# EAGLE design NIBB (EAGLE 8.1.0)
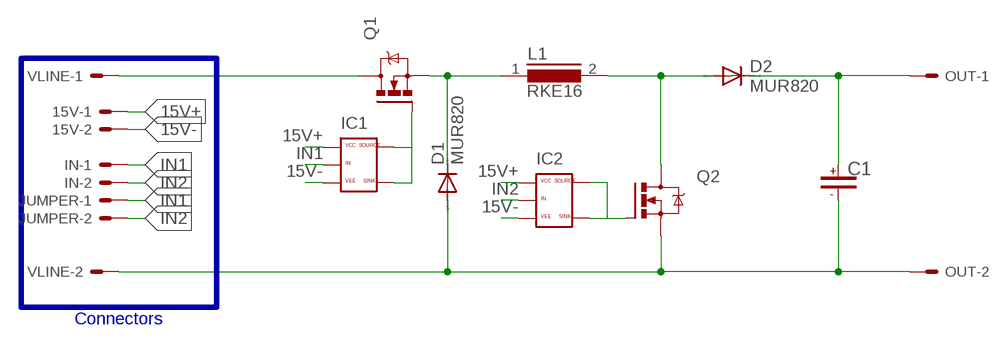
[diagram p0: schematic, sheet 1]

## Parts
15V  22-23-2021  [22-23-2021]
C1  CAPP-UF  [20ROUND40P]
D1  MUR820  [C221B1A]
D2  MUR820  [C221B1A]
IC1  ZXGD3006E6  [SOT23]
IC2  ZXGD3006E6  [SOT23]
IN  22-23-2021  [22-23-2021]
JUMPER  22-23-2021  [22-23-2021]
L1  RKE16  [RKE16]
OUT  22-23-2021  [22-23-2021]
Q1  IRF640  [TO220BV]
Q2  IRF640  [TO220BV]
VLINE  22-23-2021  [22-23-2021]

## Nets
15V+: 15V.1 IC1.1(VCC) IC2.1(VCC)
15V-: 15V.2 IC1.3(VEE) IC2.3(VEE)
IN1: IC1.2(IN) IN.1 JUMPER.1
IN2: IC2.2(IN) IN.2 JUMPER.2
N$1: D1.C L1.1 Q1.S
N$2: D2.A L1.2 Q2.D
N$3: Q1.D VLINE.1
N$4: C1.- D1.A OUT.2 Q2.S VLINE.2
N$5: IC1.4(SINK) IC1.6(SOURCE) Q1.G
N$6: IC2.4(SINK) IC2.6(SOURCE) Q2.G
N$7: C1.+ D2.C OUT.1

## Buses
B$1

## Notes on the sheet
- Connectors

## Library data of the parts
15V IN JUMPER OUT VLINE = con-molex:22-23-2021: .100" (2.54mm) Center Header - 2 Pin; MF: MOLEX; MPN: 22-23-2021; OC_FARNELL: 1462926; OC_NEWARK: 25C3832
C1 = capacitor:CAPP-U: Polarized capacitor, positive up; DESC: Capacitor, polarized
D1 D2 = diode:MUR820: DIODE
IC1 IC2 = felippe:ZXGD3006E6
L1 = inductors:RKE16: INDUCTOR
Q1 Q2 = felippe:IRF640

## Board
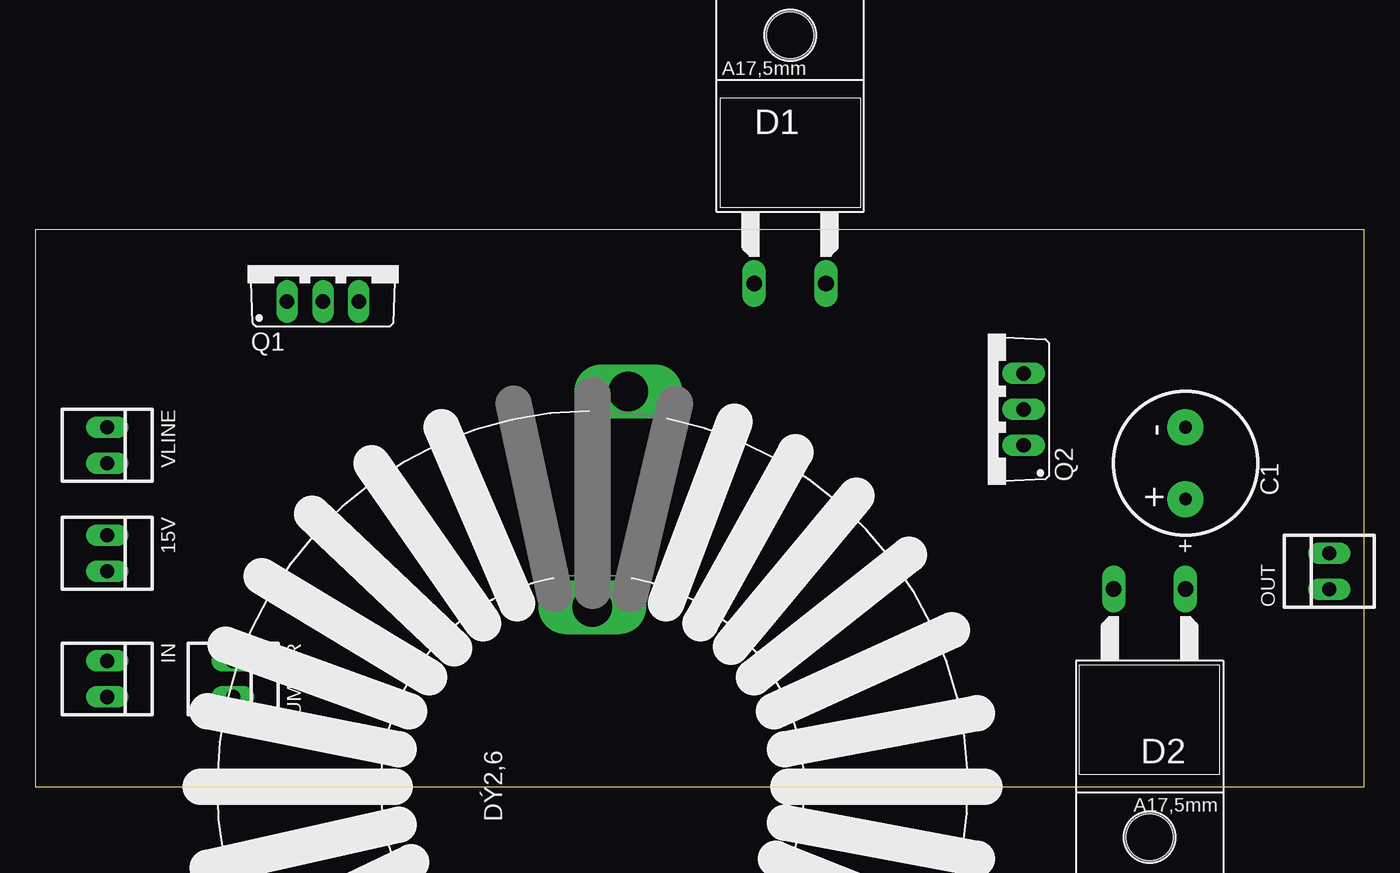
[diagram p1: board, top side]
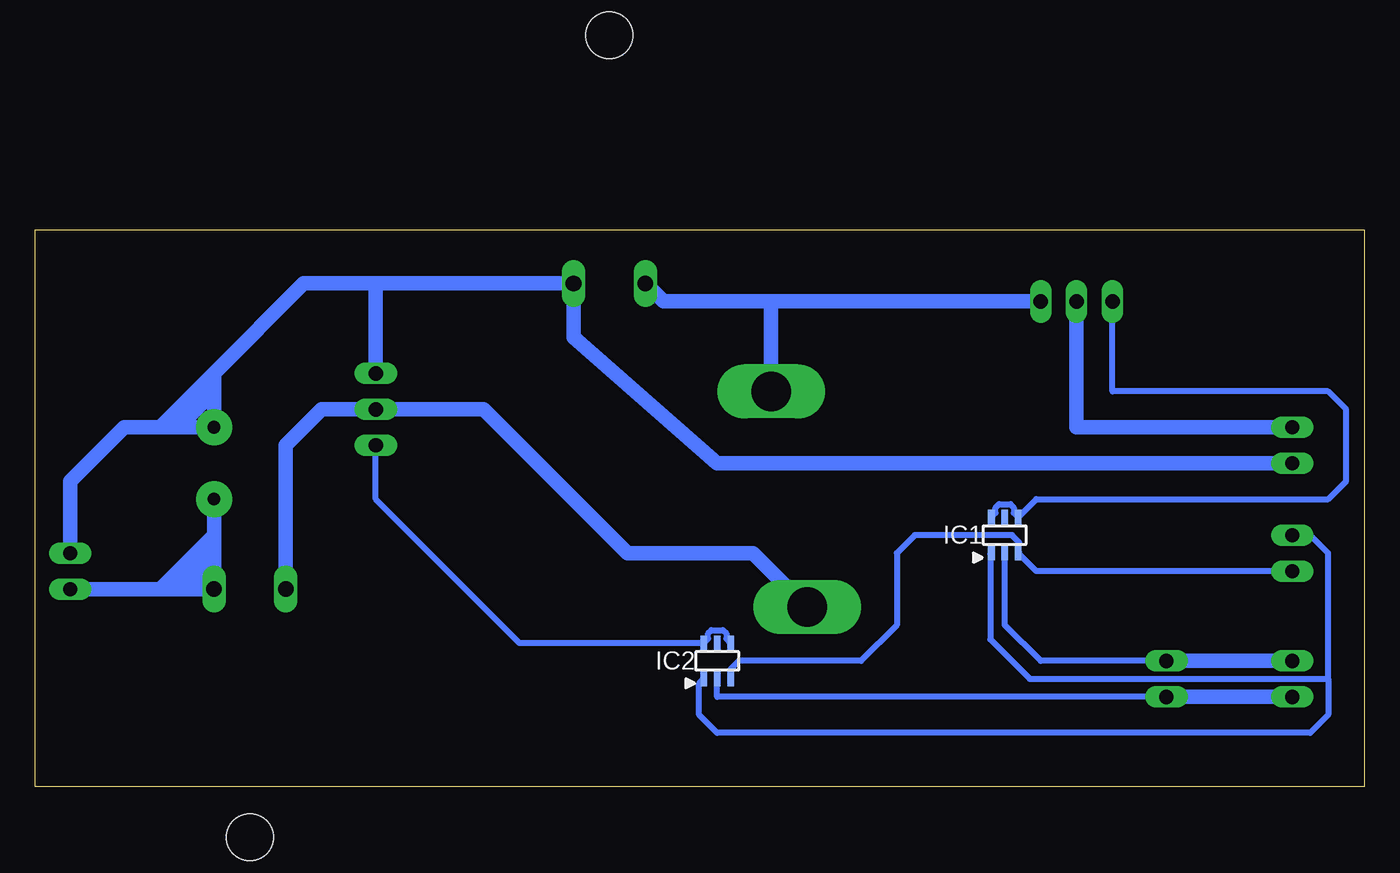
[diagram p2: board, bottom side, seen from below]

Size 93.9 x 39.36 mm. Coordinates in mm from the lower left corner, seen from the top.
Outline: 0,0 93.9,0 93.9,39.36 0,39.36 0,0
Copper layers (1*16): Top 0.035mm / dielectric 1.5mm / Bottom 0.035mm
Design rules "default": minimum track width 10mil, minimum drill 24mil, track to track 8mil, track to pad 8mil, pad to pad 8mil, via to via 8mil, smd to smd 8mil, copper to edge 40mil, drill to drill 8mil, minimum pad ring 10mil, minimum via ring 8mil, stop-mask expansion 4mil, vias tented up to drill 0mil, thermal gap 10mil

### Footprints (pad centres in the part's own frame; a part is rotated, then mirrored left to right if it is on the bottom)
22-23-2021 = drill 1 long: 1 -1.27,0; 2 1.27,0
20ROUND40P = drill 0.889 pad 2.54: + -2.54,0; - 2.54,0
C221B1A = drill 1.118 long: A 2.54,-6.35; C -2.54,-6.35 | hole 3.302: 0,11.176
SOT23 = smd 0.483 x 1.016: 1 -0.953,-1.27; 2 0,-1.27; 3 0.953,-1.27; 4 0.953,1.27; 5 0,1.27; 6 -0.953,1.27
RKE16 = drill 2.794 long: 1 -27.94,2.54; 2 -12.7,0
TO220BV = drill 1.016 long: D 0,-2.54; G -2.54,-2.54; S 2.54,-2.54

### Placement (x,y rotation side)
15V  5.08,16.51 270 top
C1  81.28,22.86 90 top
D1  53.34,41.91 0 top
D2  78.74,7.62 180 top
IC1  25.4,17.78 0 bottom
IC2  45.72,8.89 0 bottom
IN  5.08,7.62 270 top
JUMPER  13.97,7.62 270 top
L1  39.37,0 270 top
OUT  91.44,15.24 90 top
Q1  20.32,36.83 0 top
Q2  67.31,26.67 90 top
VLINE  5.08,24.13 270 top

### Tracks (layer width: path | path; a pad name or v marks a point on that pad's centre or on a via)
15V+
  Bottom 0.406: 15V.1 3.81,17.78 2.54,16.51 2.54,7.62 | 2.54,7.62 2.54,5.08 3.81,3.81 45.72,3.81 46.99,5.08 46.99,7.3 IC2.1 | IC1.1 26.42,16.45 26.42,10.41 23.62,7.62 2.54,7.62
15V-
  Bottom 0.406: 15V.2 23.18,15.24 IC1.3 24.38,16.57 24.38,17.27 24.89,17.78 31.75,17.78 33.02,16.51 33.02,11.43 35.56,8.89 44.2,8.89 44.77,8.32 IC2.3
IN1
  Bottom 0.406: JUMPER.1 22.86,8.89 25.4,11.43 IC1.2
  Bottom 1.016: IN.1 JUMPER.1
IN2
  Bottom 0.406: JUMPER.2 45.72,6.35 IC2.2
  Bottom 1.016: IN.2 JUMPER.2
N$1
  Bottom 1.016: 41.91,34.29 L1.1 | D1.C 49.53,34.29 41.91,34.29 | Q1.S 41.91,34.29
N$2
  Bottom 1.016: L1.2 43.18,16.51 52.07,16.51 62.23,26.67 Q2.D 73.66,26.67 76.2,24.13 D2.A
N$3
  Bottom 1.016: VLINE.1 20.32,25.4 Q1.D
N$4
  Bottom 1.016: 69.85,35.56 D1.A 55.88,31.75 45.72,22.86 VLINE.2 | 69.85,35.56 74.93,35.56 81.28,29.21 | Q2.S 69.85,35.56 | 83.82,25.4 85.09,25.4 | 85.09,25.4 87.63,25.4 91.44,21.59 OUT.2 | 81.28,27.94 81.28,29.21 | 81.28,29.21 85.09,25.4 | 83.82,25.4 81.28,27.94 | 81.28,27.94 C1.- 83.82,25.4
N$5
  Bottom 0.406: IC1.6 26.05,19.36 26.05,19.73 25.81,19.96 24.99,19.96 24.75,19.73 24.75,19.36 IC1.4 23.18,20.32 2.54,20.32 1.27,21.59 1.27,26.67 2.54,27.94 17.78,27.94 Q1.G
N$6
  Bottom 0.406: IC2.4 45.07,10.46 45.07,10.84 45.31,11.07 46.13,11.07 46.37,10.84 46.37,10.46 IC2.6 59.69,10.16 69.85,20.32 Q2.G
N$7
  Bottom 1.016: 82.55,13.97 D2.C 81.28,15.24 | 83.82,13.97 82.55,13.97 | 83.82,13.97 85.09,13.97 | 85.09,13.97 OUT.1 | 81.28,15.24 81.28,16.51 | 81.28,17.78 81.28,16.51 | 81.28,17.78 C1.+ | 82.55,13.97 81.28,15.24 | 81.28,16.51 83.82,13.97 | 85.09,13.97 81.28,17.78